# EAGLE design measurement (EAGLE 9.2.2)
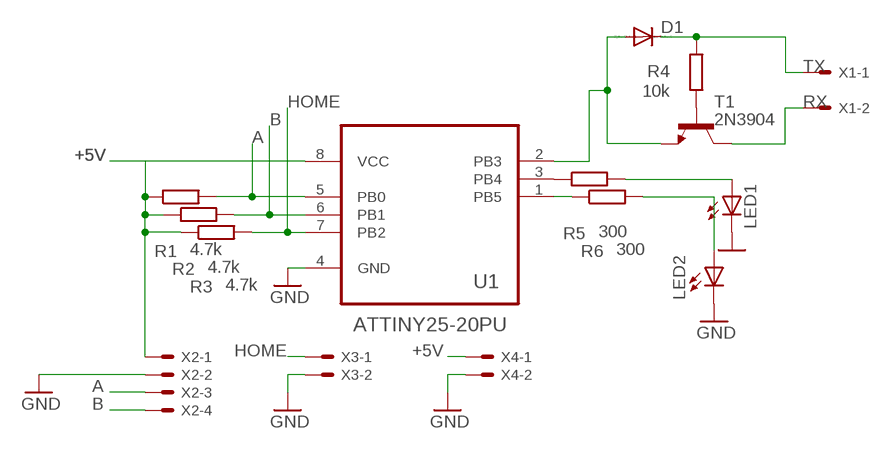
[diagram p0: schematic, sheet 1]

## Parts
D1  1N4148DO35-7  [DO35-7]
LED1  LED5MM  [LED5MM]
LED2  LED5MM  [LED5MM]
R1  4.7k  R-EU_0414/5V  [0414V]
R2  4.7k  R-EU_0414/5V  [0414V]
R3  4.7k  R-EU_0414/5V  [0414V]
R4  10k  R-EU_0414/5V  [0414V]
R5  300  R-EU_0414/5V  [0414V]
R6  300  R-EU_0414/5V  [0414V]
T1  2N3904  [TO92]
U1  ATTINY25-20PU  [DIP254P762X533-8]
X1  5566-2  [5566-2]
X2  5566-4  [5566-4]
X3  5566-2  [5566-2]
X4  5566-2  [5566-2]

## Nets
+5V: R1.1 R2.1 R3.1 U1.8(VCC) X2.1 X4.1
A: R1.2 U1.5(PB0) X2.3
B: R2.2 U1.6(PB1) X2.4
GND: LED1.K(C) LED2.K(C) U1.4(GND) X2.2 X3.2 X4.2
HOME: R3.2 U1.7(PB2) X3.1
N$2: R4.1 T1.2(B)
N$3: D1.A T1.3(E) U1.2(PB3)
N$5: R5.1 U1.3(PB4)
N$6: LED1.A R5.2
N$7: LED2.A R6.2
N$8: R6.1 U1.1(PB5)
RX: T1.1(C) X1.2
TX: D1.C R4.2 X1.1

## Library data of the parts
D1 = diode:1N4148: DIODE high speed (Philips)
LED1 LED2 = led:LED: LED OSRAM: - CHIPLED LG R971, LG N971, LY N971, LG Q971, LY Q971, LO R971, LY R971 LH N974, LH R974 LS Q976, LO Q976, LY Q976 LO Q996 - Hyper CHIPLED LW Q18S LB Q993, LB Q99A, LB R99A - SideLED LS A670, LO A670, LY A670, LG A670, LP A670 LB A673, LV A673, LT A673, LW A673 LH A674 LY A675 LS A676, LA A676, LO A676, LY A676, LW A676 LS A679, LY A679, LG A679 - Hyper Micro SIDELED® LS Y876, LA Y876, LO Y876, LY Y876 LT Y87S - SmartLED LW L88C, LW L88S LB L89C, LB L89S, LG L890 LS L89K, LO L89K, LY L89K LS L896, LA L896, LO L896, LY L896 - TOPLED LS T670, LO T670, LY T670, LG T670, LP T670 LSG T670, LSP T670, LSY T670, LOP T670, LYG T670 LG T671, LOG T671, LSG T671 LB T673, LV T673, LT T673, LW T673 LH T674 LS T676, LA T676, LO T676, LY T676, LB T676, LH T676, LSB T676, LW T676 LB T67C, LV T67C, LT T67C, LS T67K, LO T67K, LY T67K, LW E67C LS E67B, LA E67B, LO E67B, LY E67B, LB E67C, LV E67C, LT E67C LW T67C LS T679, LY T679, LG T679 LS T770, LO T770, LY T770, LG T770, LP T770 LB T773, LV T773, LT T773, LW T773 LH T774 LS E675, LA E675, LY E675, LS T675 LS T776, LA T776, LO T776, LY T776, LB T776 LHGB T686 LT T68C, LB T68C - Hyper Mini TOPLED® LB M676 - Mini TOPLED Santana® LG M470 LS M47K, LO M47K, LY M47K Source: http://www.osram.convergy.de LUXEON: - LUMILED® LXK2-PW12-R00, LXK2-PW12-S00, LXK2-PW14-U00, LXK2-PW14-V00 LXK2-PM12-R00, LXK2-PM12-S00, LXK2-PM14-U00 LXK2-PE12-Q00, LXK2-PE12-R00, LXK2-PE12-S00, LXK2-PE14-T00, LXK2-PE14-U00 LXK2-PB12-K00, LXK2-PB12-L00, LXK2-PB12-M00, LXK2-PB14-N00, LXK2-PB14-P00, LXK2-PB14-Q00 LXK2-PR12-L00, LXK2-PR12-M00, LXK2-PR14-Q00, LXK2-PR14-R00 LXK2-PD12-Q00, LXK2-PD12-R00, LXK2-PD12-S00 LXK2-PH12-R00, LXK2-PH12-S00 LXK2-PL12-P00, LXK2-PL12-Q00, LXK2-PL12-R00 Source: www.luxeon.com KINGBRIGHT: KA-3528ASYC Source: www.kingbright.com
R1-R6 = rcl:R-EU_: RESISTOR, European symbol; SPICEPREFIX: R
T1 = transistor:2N3904: NPN TRANSISTOR
U1 = ATTINY25-20PU:ATTINY25-20PU: 8-bit Microcontroller with 2/4/8KBytes In-System Programmable Flash; AVAILABILITY: Unavailable; DESCRIPTION: ATtiny Series 20 MHz 2 KB Flash 128 B SRAM 8-Bit Microcontroller - DIP-8; MF: Microchip; MP: ATTINY25-20PU; PACKAGE: DIP-8 Microchip; PRICE: None
X1 X3 X4 = con-molex:5566-2: Mini FIT connector 2 pol Source: http://www.molex.com; MF: MOLEX; OC_FARNELL: 1822072; OC_NEWARK: unknown
X2 = con-molex:5566-4: Mini FIT connector 4 pol Source: http://www.molex.com; MF: MOLEX; OC_FARNELL: unknown; OC_NEWARK: unknown

## Board
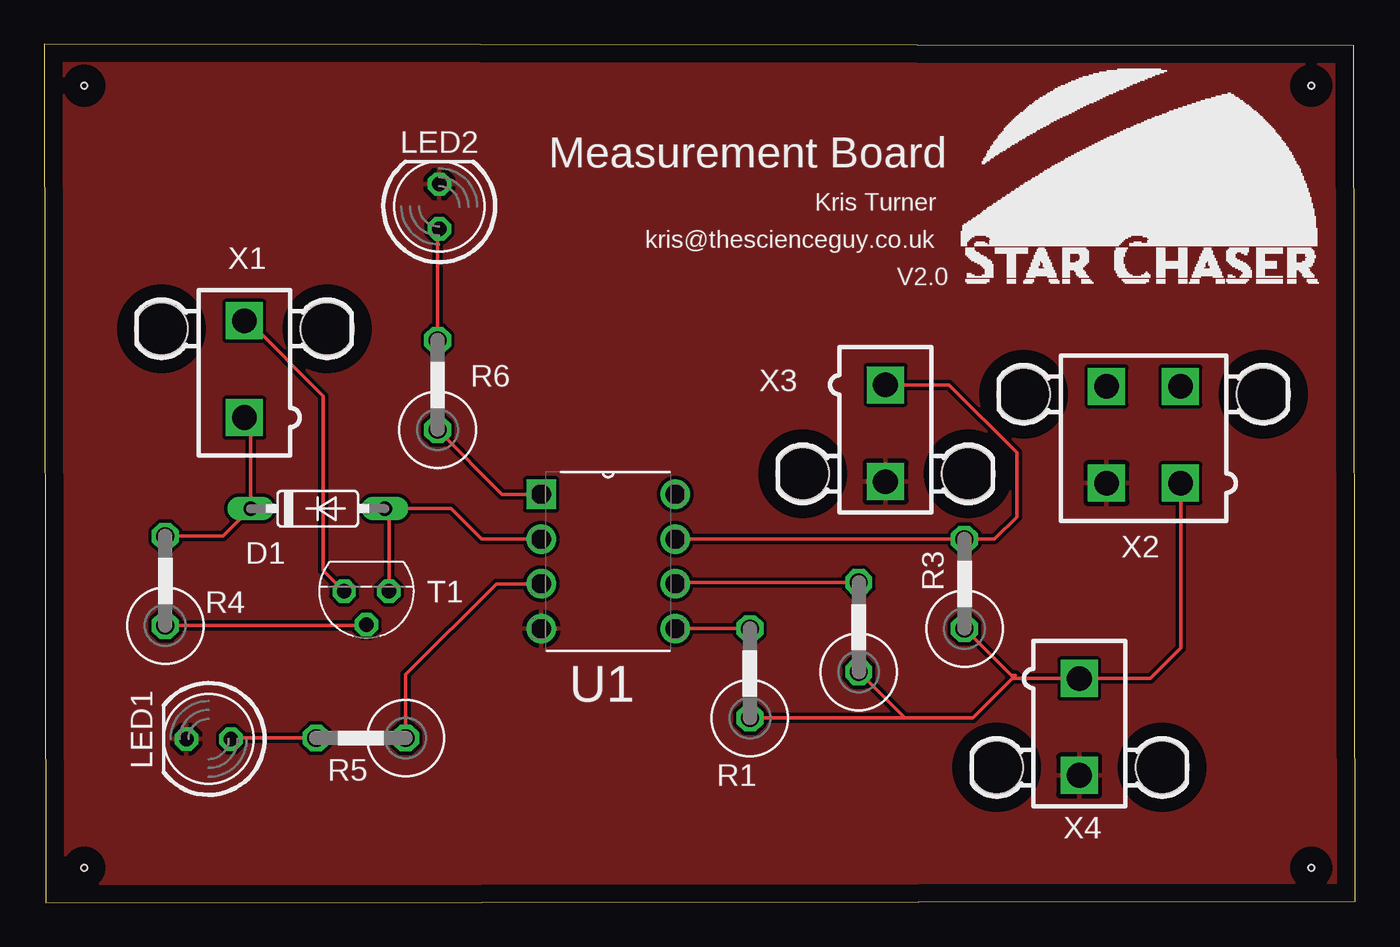
[diagram p1: board, top side]
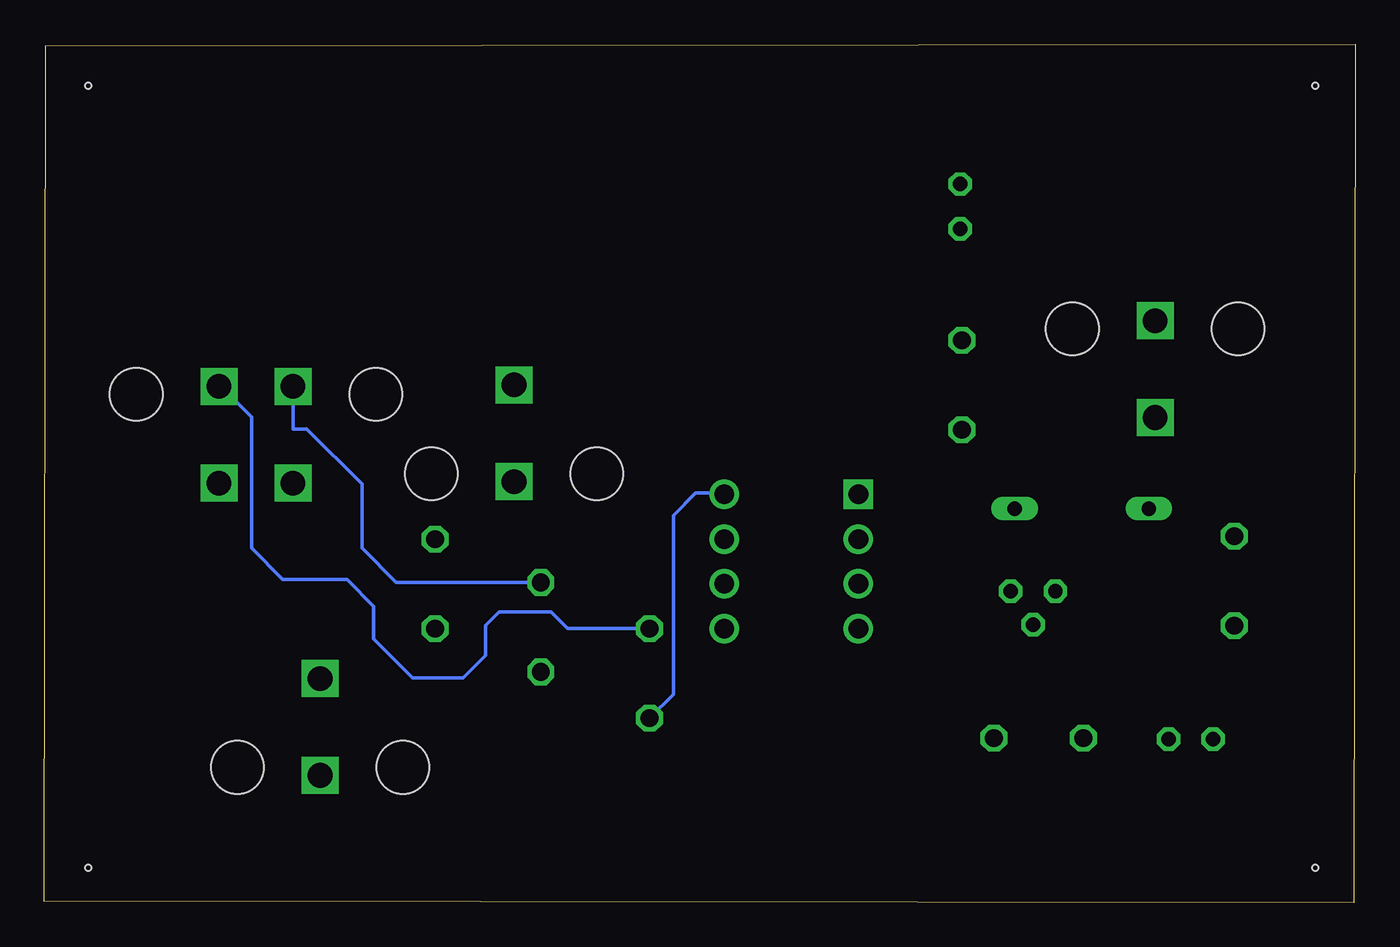
[diagram p2: board, bottom side, seen from below]

Size 74.45 x 48.76 mm. Coordinates in mm from the lower left corner, seen from the top.
Outline: 0,48.76 0.09,0 74.46,0.08 74.37,48.67 0,48.76
Copper layers (1*16): Top 0.035mm / dielectric 1.5mm / Bottom 0.035mm
Design rules "default *": minimum track width 8mil, minimum drill 0.35mm, track to track 8mil, track to pad 8mil, pad to pad 6mil, via to via 6mil, smd to smd 6mil, copper to edge 40mil, drill to drill 6mil, minimum pad ring 10mil, minimum via ring 8mil, stop-mask expansion 4mil, vias tented up to drill 0mil, thermal gap 10mil
Holes 0.35 mm at 2.29,1.99 71.95,1.99 71.95,46.4 2.29,46.4

### Footprints (pad centres in the part's own frame; a part is rotated, then mirrored left to right if it is on the bottom)
DO35-7 = drill 0.813 long: A 3.81,0; C -3.81,0
LED5MM = drill 0.813 octagon: A -1.27,0; K 1.27,0
0414V = drill 1.016 octagon: 1 -2.54,0; 2 2.54,0
TO92 = drill 0.813 octagon: 1 1.27,0; 2 0,1.905; 3 -1.27,0
DIP254P762X533-8 = drill 1.118 square: 1 -7.62,7.62 | drill 1.118: 2 -7.62,5.08; 3 -7.62,2.54; 4 -7.62,0; 5 0,0; 6 0,2.54; 7 0,5.08; 8 0,7.62
5566-2 = drill 1.4 square: 1 0,-2.75; 2 0,2.75 | hole 3: 4.7,2.29; -4.7,2.29
5566-4 = drill 1.4 square: 1 2.1,-2.75; 2 -2.1,-2.75; 3 2.1,2.75; 4 -2.1,2.75 | hole 3: 6.8,2.29; -6.8,2.29

### Placement (x,y rotation side)
D1  15.54,22.38 0 top
LED1  9.35,9.3 180 top
LED2  22.44,39.54 90 top
R1  40.07,13.02 90 top
R2  46.25,15.65 90 top
R3  52.26,18.1 90 top
R4  6.89,18.27 90 top
R5  17.98,9.35 180 top
R6  22.35,29.4 90 top
T1  18.31,17.69 180 top
U1  35.84,15.57 0 top
X1  11.37,30.3 0 top
X2  62.42,26.57 0 top
X3  47.77,26.66 180 top
X4  58.78,9.98 180 top

### Tracks (layer width: path | path; a pad name or v marks a point on that pad's centre or on a via)
+5V
  Top 0.203: 54.97,12.73 X4.1 62.8,12.73 64.54,14.47 64.54,23.81 X2.1 | R3.1 54.93,12.9 55.14,12.9 54.97,12.73 | 54.97,12.73 52.72,10.48 48.88,10.48 | 48.88,10.48 R1.1 | R2.1 48.88,10.48
  Bottom 0.203: R1.1 38.71,11.84 38.71,22 37.46,23.25 35.9,23.25 U1.8
A
  Top 0.203: R1.2 36.52,15.56 36.51,15.57 U1.5
  Bottom 0.203: R1.2 44.72,15.56 45.66,16.5 48.62,16.5 49.38,15.74 49.38,14.04 50.65,12.77 53.53,12.77 55.73,14.97 55.73,16.84 57.25,18.36 60.9,18.36 62.67,20.14 62.67,27.59 64.41,29.32 X2.3
B
  Top 0.203: R2.2 35.84,18.19 U1.6
  Bottom 0.203: R2.2 54.46,18.19 56.41,20.14 56.41,23.78 59.54,26.91 60.3,26.91 60.3,29.31 X2.4
GND
  pour Top: 77,50.23 77,-2.51 -2.23,-2.51 -2.23,50.23
HOME
  Top 0.203: U1.7 R3.2 53.95,20.64 55.22,21.92 55.22,25.56 51.37,29.41 X3.1
N$2
  Top 0.203: R4.1 18.26,15.73 T1.2
N$3
  Top 0.203: D1.A 19.41,22.37 | 19.41,22.37 23.11,22.37 24.83,20.65 U1.2 | T1.3 19.58,22.21 19.41,22.37
N$5
  Top 0.203: R5.1 20.52,12.95 25.68,18.11 U1.3
N$6
  Top 0.203: R5.2 10.67,9.35 LED1.A
N$7
  Top 0.203: R6.2 22.35,38.17 LED2.A
N$8
  Top 0.203: U1.1 26.01,23.19 R6.1
RX
  Top 0.203: X1.2 11.58,33.05 15.86,28.77 15.86,18.87 T1.1
TX
  Top 0.203: R4.2 10.17,20.81 D1.C 11.73,26.64 11.45,26.91 11.45,27.46 X1.1

### Text on the board
tPlace: Measurement Board | Kris Turner | kris@thescienceguy.co.uk | V2.0